# Altium schematic sheet STM32F4_MCU.SchDoc
size A3; SheetNumber: 3; SheetTotal: 3
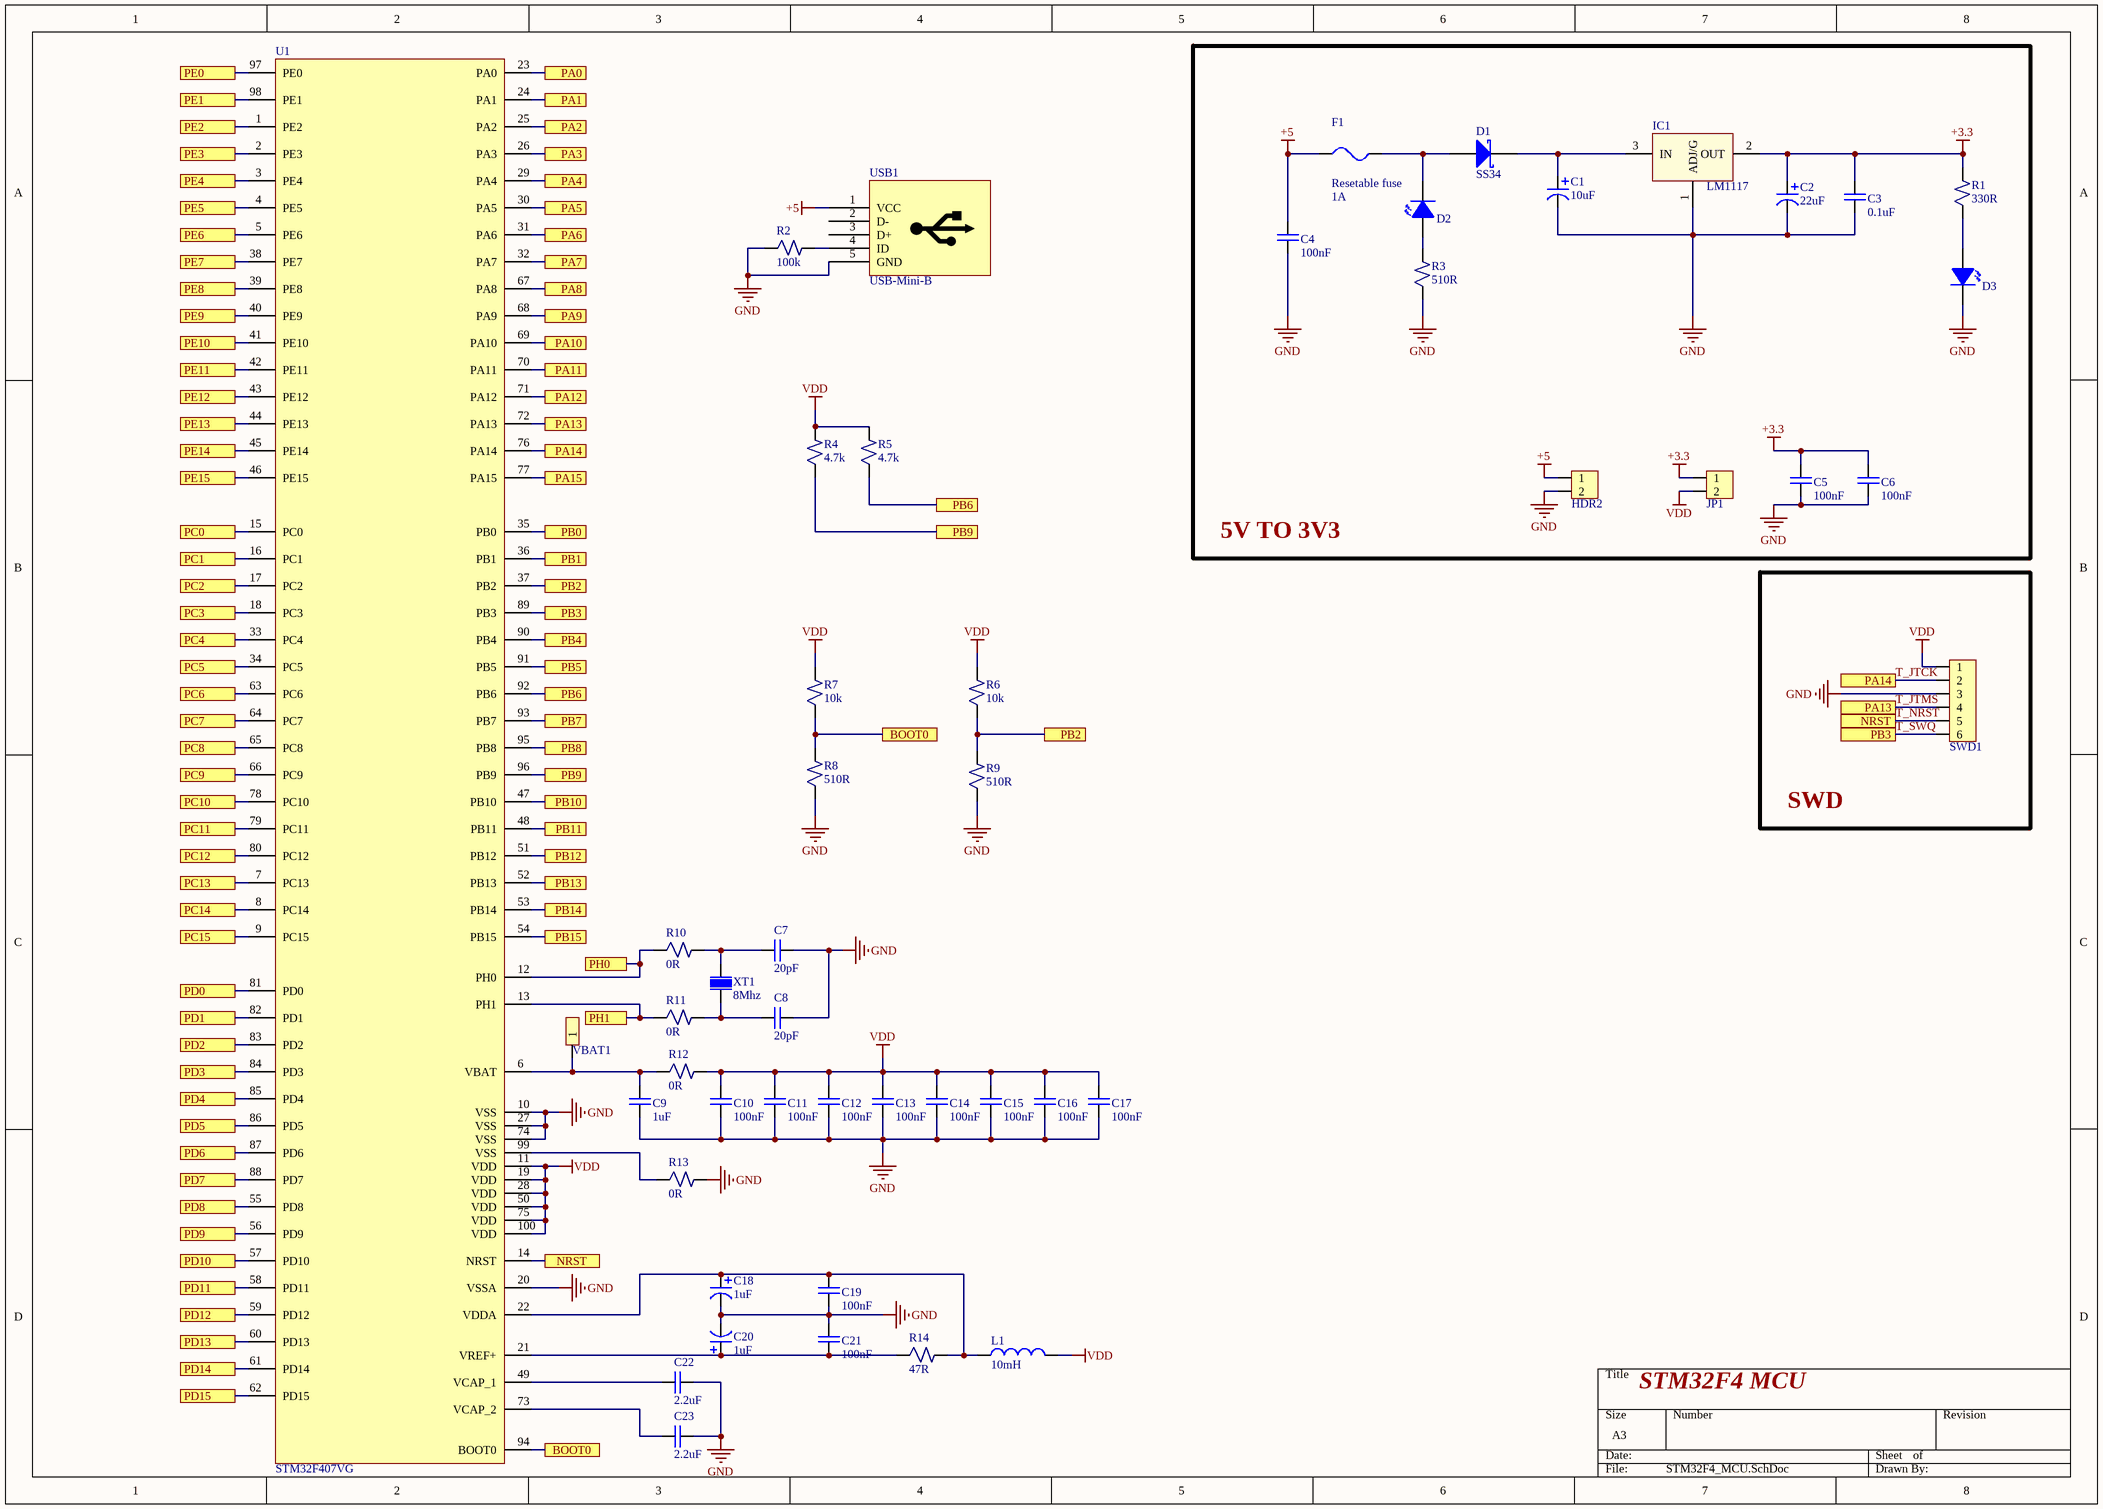
[diagram p0: STM32F4_MCU.SchDoc]

## Parts
C1  value 10uF  [C3216-Tantalum]  (hidden comment: Cap Tantalum)
C2  value 22uF  [C3216-Tantalum]  (hidden comment: Cap Pol)
C3  value 0.1uF  [C0805]  (hidden comment: Cap Non-Pol)
C4  value 100nF  [C0805]  (hidden comment: Cap Non-Pol)
C5  value 100nF  [C0805]  (hidden comment: Cap Non-Pol)
C6  value 100nF  [C0805]  (hidden comment: Cap Non-Pol)
C7  value 20pF  [C0805]  (hidden comment: Cap Non-Pol)
C8  value 20pF  [C0805]  (hidden comment: Cap Non-Pol)
C9  value 1uF  [C0805]  (hidden comment: Cap Non-Pol)
C10  value 100nF  [C0805]  (hidden comment: Cap Non-Pol)
C11  value 100nF  [C0805]  (hidden comment: Cap Non-Pol)
C12  value 100nF  [C0805]  (hidden comment: Cap Non-Pol)
C13  value 100nF  [C0805]  (hidden comment: Cap Non-Pol)
C14  value 100nF  [C0805]  (hidden comment: Cap Non-Pol)
C15  value 100nF  [C0805]  (hidden comment: Cap Non-Pol)
C16  value 100nF  [C0805]  (hidden comment: Cap Non-Pol)
C17  value 100nF  [C0805]  (hidden comment: Cap Non-Pol)
C18  value 1uF  [C3216-Tantalum]  (hidden comment: Cap Pol)
C19  value 100nF  [C0805]  (hidden comment: Cap Non-Pol)
C20  value 1uF  [C3216-Tantalum]  (hidden comment: Cap Pol)
C21  value 100nF  [C0805]  (hidden comment: Cap Non-Pol)
C22  value 2.2uF  [C0805]  (hidden comment: Cap Non-Pol)
C23  value 2.2uF  [C0805]  (hidden comment: Cap Non-Pol)
D1  SS34  [SMA]
D2  LED  [LED0805]  (value not drawn)
D3  LED  [LED0805]  (value not drawn)
F1  Resetable fuse  MaxCurrent: 1A  [FUSE SMD]
HDR2  Header-2  [Header-2]  (value not drawn)
IC1  LM1117  [SOT-223/SC-73]
JP1  Header-2  [Header-2]  (value not drawn)
L1  value 10mH  [R0805]  (hidden comment: Inductor)
R1  value 330R  [R0805]  (hidden comment: Resistor)
R2  value 100k  [R0805]  (hidden comment: Resistor)
R3  value 510R  [R0805]  (hidden comment: Resistor)
R4  value 4.7k  [R0805]  (hidden comment: Resistor)
R5  value 4.7k  [R0805]  (hidden comment: Resistor)
R6  value 10k  [R0805]  (hidden comment: Resistor)
R7  value 10k  [R0805]  (hidden comment: Resistor)
R8  value 510R  [R0805]  (hidden comment: Resistor)
R9  value 510R  [R0805]  (hidden comment: Resistor)
R10  value 0R  [R0805]  (hidden comment: Resistor)
R11  value 0R  [R0805]  (hidden comment: Resistor)
R12  value 0R  [R0805]  (hidden comment: Resistor)
R13  value 0R  [R0805]  (hidden comment: Resistor)
R14  value 47R  [R0805]  (hidden comment: Resistor)
SWD1  Header-6  [Header-6]  (value not drawn)
U1  STM32F407VG  [LQFP100]
USB1  USB-Mini-B  [USB_B_MINI_SMD]
VBAT1  Header-1  [Header-1]  (value not drawn)
XT1  Frequency: 8Mhz  [XT2]  (hidden comment: XTAL)

## Blocks framed on the sheet
5V TO 3V3: C1-C6 D1-D3 F1 HDR2 IC1 JP1 R1 R3
SWD: SWD1

## Ports
BOOT0, NRST, PA0, PA1, PA2, PA3, PA4, PA5, PA6, PA7, PA8, PA9, PA10, PA11, PA12, PA13, PA14, PA15, PB0, PB1, PB2, PB3, PB4, PB5, PB6, PB7, PB8, PB9, PB10, PB11, PB12, PB13, PB14, PB15, PC0, PC1, PC2, PC3, PC4, PC5, PC6, PC7, PC8, PC9, PC10, PC11, PC12, PC13, PC14, PC15, PD0, PD1, PD2, PD3, PD4, PD5, PD6, PD7, PD8, PD9, PD10, PD11, PD12, PD13, PD14, PD15, PE0, PE1, PE2, PE3, PE4, PE5, PE6, PE7, PE8, PE9, PE10, PE11, PE12, PE13, PE14, PE15, PH0, PH1

## Nets
+3.3: C2.1 C3.2 C5.2 C6.2 IC1.2(OUT) JP1.1 R1.2
+5: C4.2 F1.1 HDR2.1 USB1.1(VCC)
GND: C1.2 C2.2 C3.1 C4.1 C5.1 C6.1 C7.2 C8.2 C9.2 C10.2 C11.2 C12.2 C13.2 C14.2 C15.2 C16.2 C17.2 C18.2 C19.1 C20.2 C21.1 C22.2 C23.2 D3.2 HDR2.2 IC1.1(ADJ/G) R2.1 R3.1 R8.1 R9.1 R13.2 SWD1.3 U1.10(VSS) U1.20(VSSA) U1.27(VSS) U1.74(VSS) USB1.5(GND)
VDD: C10.1 C11.1 C12.1 C13.1 C14.1 C15.1 C16.1 C17.1 JP1.2 L1.2 R4.2 R5.2 R6.2 R7.2 R12.2 SWD1.1 U1.11(VDD) U1.19(VDD) U1.28(VDD) U1.50(VDD) U1.75(VDD) U1.100(VDD)
BOOT0: R7.1 R8.2 U1.94(BOOT0) ; port BOOT0
PA0: U1.23(PA0) ; port PA0
PA1: U1.24(PA1) ; port PA1
PA2: U1.25(PA2) ; port PA2
PA3: U1.26(PA3) ; port PA3
PA4: U1.29(PA4) ; port PA4
PA5: U1.30(PA5) ; port PA5
PA6: U1.31(PA6) ; port PA6
PA7: U1.32(PA7) ; port PA7
PA8: U1.67(PA8) ; port PA8
PA9: U1.68(PA9) ; port PA9
PA10: U1.69(PA10) ; port PA10
PA11: U1.70(PA11) ; port PA11
PA12: U1.71(PA12) ; port PA12
PA15: U1.77(PA15) ; port PA15
PB0: U1.35(PB0) ; port PB0
PB1: U1.36(PB1) ; port PB1
PB2: R6.1 R9.2 U1.37(PB2) ; port PB2
PB4: U1.90(PB4) ; port PB4
PB5: U1.91(PB5) ; port PB5
PB6: R5.1 U1.92(PB6) ; port PB6
PB7: U1.93(PB7) ; port PB7
PB8: U1.95(PB8) ; port PB8
PB9: R4.1 U1.96(PB9) ; port PB9
PB10: U1.47(PB10) ; port PB10
PB11: U1.48(PB11) ; port PB11
PB12: U1.51(PB12) ; port PB12
PB13: U1.52(PB13) ; port PB13
PB14: U1.53(PB14) ; port PB14
PB15: U1.54(PB15) ; port PB15
PC0: U1.15(PC0) ; port PC0
PC1: U1.16(PC1) ; port PC1
PC2: U1.17(PC2) ; port PC2
PC3: U1.18(PC3) ; port PC3
PC4: U1.33(PC4) ; port PC4
PC5: U1.34(PC5) ; port PC5
PC6: U1.63(PC6) ; port PC6
PC7: U1.64(PC7) ; port PC7
PC8: U1.65(PC8) ; port PC8
PC9: U1.66(PC9) ; port PC9
PC10: U1.78(PC10) ; port PC10
PC11: U1.79(PC11) ; port PC11
PC12: U1.80(PC12) ; port PC12
PC13: U1.7(PC13) ; port PC13
PC14: U1.8(PC14) ; port PC14
PC15: U1.9(PC15) ; port PC15
PD0: U1.81(PD0) ; port PD0
PD1: U1.82(PD1) ; port PD1
PD2: U1.83(PD2) ; port PD2
PD3: U1.84(PD3) ; port PD3
PD4: U1.85(PD4) ; port PD4
PD5: U1.86(PD5) ; port PD5
PD6: U1.87(PD6) ; port PD6
PD7: U1.88(PD7) ; port PD7
PD8: U1.55(PD8) ; port PD8
PD9: U1.56(PD9) ; port PD9
PD10: U1.57(PD10) ; port PD10
PD11: U1.58(PD11) ; port PD11
PD12: U1.59(PD12) ; port PD12
PD13: U1.60(PD13) ; port PD13
PD14: U1.61(PD14) ; port PD14
PD15: U1.62(PD15) ; port PD15
PE0: U1.97(PE0) ; port PE0
PE1: U1.98(PE1) ; port PE1
PE2: U1.1(PE2) ; port PE2
PE3: U1.2(PE3) ; port PE3
PE4: U1.3(PE4) ; port PE4
PE5: U1.4(PE5) ; port PE5
PE6: U1.5(PE6) ; port PE6
PE7: U1.38(PE7) ; port PE7
PE8: U1.39(PE8) ; port PE8
PE9: U1.40(PE9) ; port PE9
PE10: U1.41(PE10) ; port PE10
PE11: U1.42(PE11) ; port PE11
PE12: U1.43(PE12) ; port PE12
PE13: U1.44(PE13) ; port PE13
PE14: U1.45(PE14) ; port PE14
PE15: U1.46(PE15) ; port PE15
PH0: R10.1 U1.12(PH0) ; port PH0
PH1: R11.1 U1.13(PH1) ; port PH1
T_JTCK: SWD1.2 U1.76(PA14) ; port PA14
T_JTMS: SWD1.4 U1.72(PA13) ; port PA13
T_NRST: SWD1.5 U1.14(NRST) ; port NRST
T_SWQ: SWD1.6 U1.89(PB3) ; port PB3
NetC1_1: C1.1 D1.2(K) IC1.3(IN)
NetC7_1: C7.1 R10.2 XT1.2
NetC8_1: C8.1 R11.2 XT1.1
NetC9_1: C9.1 R12.1 U1.6(VBAT) VBAT1.1
NetC18_1: C18.1 C19.2 L1.1 R14.2 U1.22(VDDA)
NetC20_1: C20.1 C21.2 R14.1 U1.21(VREF+)
NetC22_1: C22.1 U1.49(VCAP_1)
NetC23_1: C23.1 U1.73(VCAP_2)
NetD1_1: D1.1(A) D2.2 F1.2
NetD2_1: D2.1 R3.2
NetD3_1: D3.1 R1.1
NetR2_2: R2.2 USB1.4(ID)
NetR13_1: R13.1 U1.99(VSS)

Not connected (* = marked no-connect by the designer): USB1 2(D-) 3(D+)

## Notes on the sheet
- STM32F4 MCU

## Library data of the parts
C1 = Cap Pol_2: Polarized Capacitor
C2 = Cap Pol_1: Polarized Capacitor
C3 = Cap Non-Pol_4: Non-Polarized Capacitor
C4-C6 C10-C17 C19 C21 = Cap Non-Pol: Non-Polarized Capacitor
C7 C8 = Cap Non-Pol_3: Non-Polarized Capacitor
C9 = Cap Non-Pol_1: Non-Polarized Capacitor
C18 C20 = Cap Pol: Polarized Capacitor
C22 C23 = Cap Non-Pol_2: Non-Polarized Capacitor
D1 = Diode Schottky: Schottky Diode; Published: 8-Jun-2000; LatestRevisionDate: 17-Jul-2002; LatestRevisionNote: Re-released for DXP Platform.; PackageReference: SMB; Publisher: Altium Limited; PackageDescription: DO-214-AA/SMB; 2 C-Bend Leads; Body 5.3 x 3.6 mm, inc. leads (LxW); Code_JEDEC: DO-214-AA
F1 = Fuse
HDR2 JP1 = Header-2: Header 2 pins
IC1 = LM1117: Available in 1.8V, 2.5V, 2.85V, 3.3V, 5V, and  Adjustable Versions; Value: LM317
R1 = Resistor_5
R2 = Resistor_6
R3 R8 R9 = Resistor_3
R4 R5 = Resistor_4
R6 R7 = Resistor_2
R10-R13 = Resistor_1
SWD1 = Header-6: Header 6 pins
USB1 = USB-Mini
VBAT1 = Header-1: Header 1 pin
XT1 = XTAL: Crystal